# EAGLE design flight_teeny (EAGLE 9.2.2)
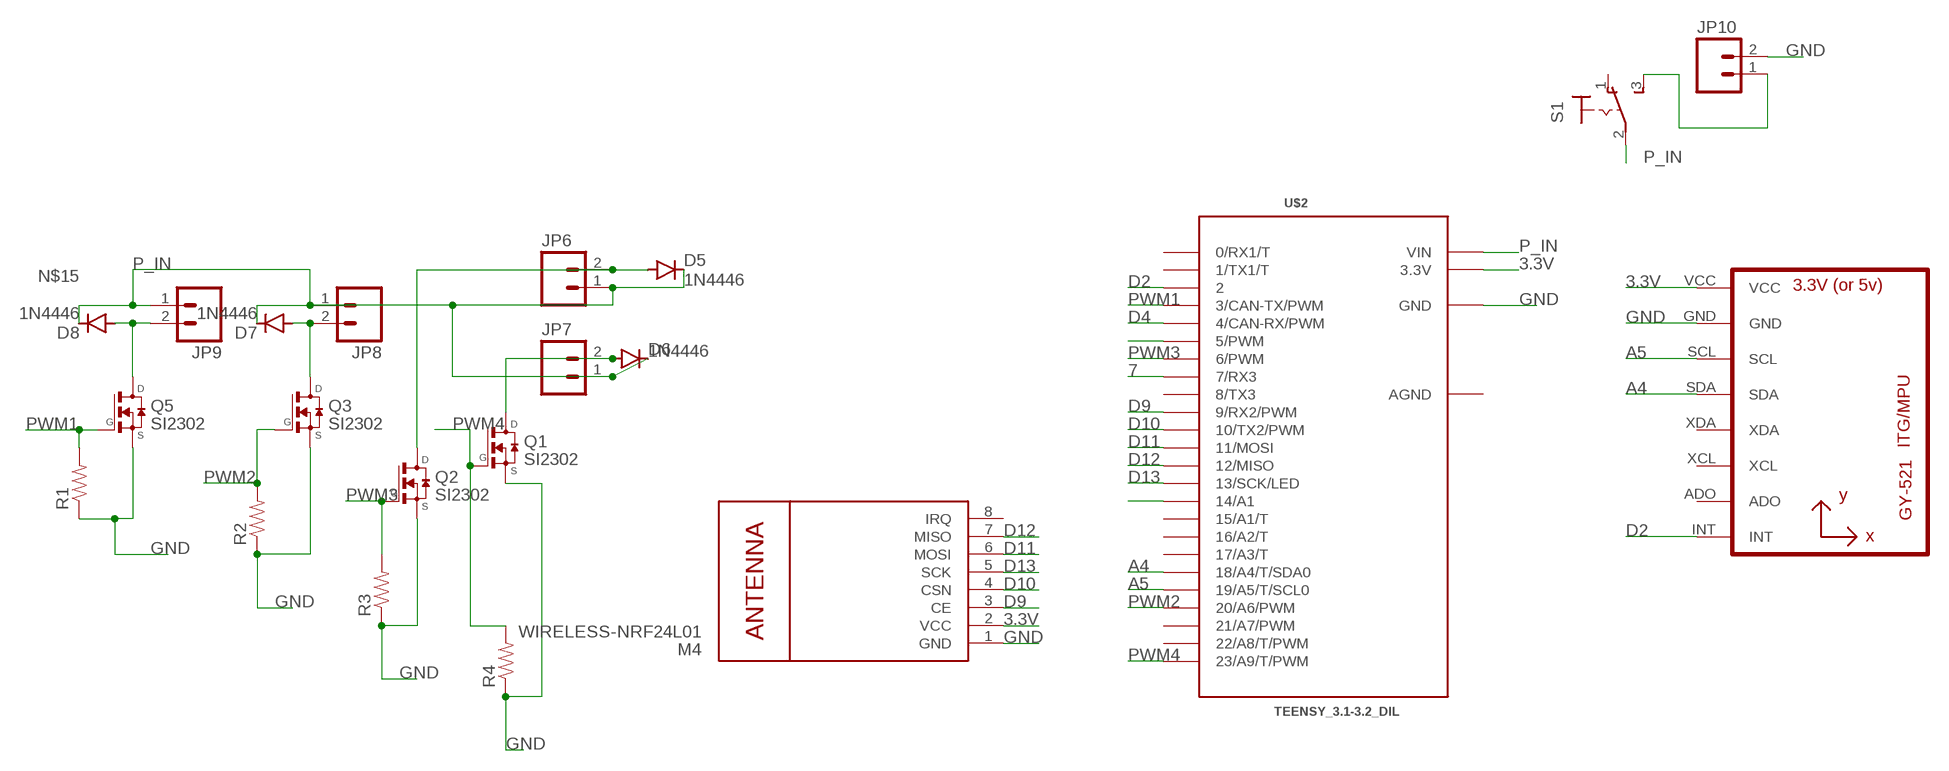
[diagram p0: schematic, sheet 1]

## Parts
D5  1N4446  [DO35-10]
D6  1N4446  [DO35-10]
D7  1N4446  [DO35-10]
D8  1N4446  [DO35-10]
JP6  M021X02_NO_SILK  [1X02_NO_SILK]
JP7  M021X02_NO_SILK  [1X02_NO_SILK]
JP8  M021X02_NO_SILK  [1X02_NO_SILK]
JP9  M021X02_NO_SILK  [1X02_NO_SILK]
JP10  M02PTH  [1X02]
M4  WIRELESS-NRF24L01  [WIRELESS-NRF24L01]
Q1  SI2302  [SOT23]
Q2  SI2302  [SOT23]
Q3  SI2302  [SOT23]
Q5  SI2302  [SOT23]
R1  RESISTORAXIAL-0.3  [AXIAL-0.3]
R2  RESISTORAXIAL-0.3  [AXIAL-0.3]
R3  RESISTORAXIAL-0.3  [AXIAL-0.3]
R4  RESISTORAXIAL-0.3  [AXIAL-0.3]
S1  M9040P  [M9040P]
U2  GY-521MPU6050  [GY-521]
U$2  TEENSY_3.1-3.2_DIL  [TEENSY_3.0-3.2&LC_DIL]

## Nets
3.3V: M4.2(VCC) U2.VCC U$2.3.3V
7: U$2.7(7/RX3)
A4: U2.SDA U$2.18/A4(18/A4/T/SDA0)
A5: U2.SCL U$2.19/A5(19/A5/T/SCL0)
D2: U2.INT U$2.2
D4: U$2.4(4/CAN-RX/PWM)
D9: M4.3(CE) U$2.9(9/RX2/PWM)
D10: M4.4(CSN) U$2.10(10/TX2/PWM)
D11: M4.6(MOSI) U$2.11(11/MOSI)
D12: M4.7(MISO) U$2.12(12/MISO)
D13: M4.5(SCK) U$2.13(13/SCK/LED)
GND: JP10.2 M4.1(GND) Q1.2(S) Q2.2(S) Q3.2(S) Q5.2(S) R1.P$1 R2.P$1 R3.P$1 R4.P$1 U2.GND U$2.GND
N$1: U$2.5(5/PWM)
N$2: D6.A JP7.2 Q1.3(D)
N$15: D8.A JP9.2 Q5.3(D)
N$20: U$2.14/A0(14/A1)
N$21: D5.A JP6.2 Q2.3(D)
N$24: D7.A JP8.2 Q3.3(D)
N$30: JP10.1 S1.3(S)
P_IN: D5.C D6.C D7.C D8.C JP6.1 JP7.1 JP8.1 JP9.1 S1.2(P) U$2.VIN
PWM1: Q5.1(G) R1.P$2 U$2.3(3/CAN-TX/PWM)
PWM2: Q3.1(G) R2.P$2 U$2.20/A6(20/A6/PWM)
PWM3: Q2.1(G) R3.P$2 U$2.6(6/PWM)
PWM4: Q1.1(G) R4.P$2 U$2.23/A9(23/A9/T/PWM)
Unconnected: M4.8(IRQ) S1.1(O) U2.ADO U2.XCL U2.XDA U$2.0(0/RX1/T) U$2.1(1/TX1/T) U$2.8(8/TX3) U$2.15/A1(15/A1/T) U$2.16/A2(16/A2/T) U$2.17/A3(17/A3/T) U$2.21/A7(21/A7/PWM) U$2.22/A8(22/A8/T/PWM)

## Power pins joined to a net without a drawn wire
AGND: U$2.AGND

## Library data of the parts
D5-D8 = diode:1N4446: DIODE high speed (Philips)
JP6-JP10 = SparkFun:M02: Header 2 Standard 2-pin 0.1" header. Use with straight break away headers (SKU : PRT-00116), right angle break away headers (PRT-00553), swiss pins (PRT-00743), machine pins (PRT-00117), and female headers (PRT-00115). Molex polarized connector foot print use with SKU : PRT-08233 with associated crimp pins and housings.
M4 = diy-modules:WIRELESS-NRF24L01: 2.4 GHz Wireless Module based on NRF24L01 chip More details available here: http://www.electrodragon.com/w/NRF24L01 Click here to find device on ebay.com <http://www.ebay.com/sch/nrf24l01+arduino>
Q1-Q3 Q5 = transistor-fet:SI2302: MOSFET N-Channel 20 V (D-S)
R1-R4 = SparkFun:RESISTOR: Resistor Basic schematic elements and footprints for 0603, 1206, and PTH resistors.
S1 = switch:M9040P: TOGGLE SWITCH Marquardt
U2 = gy-521:GY-521
U$2 = Teensy_3_and_LC_Series_Boards_v1.4:TEENSY_3.1-3.2_DIL: Teensy 3.1 or 3.2 in a DIL Layout.

## Board
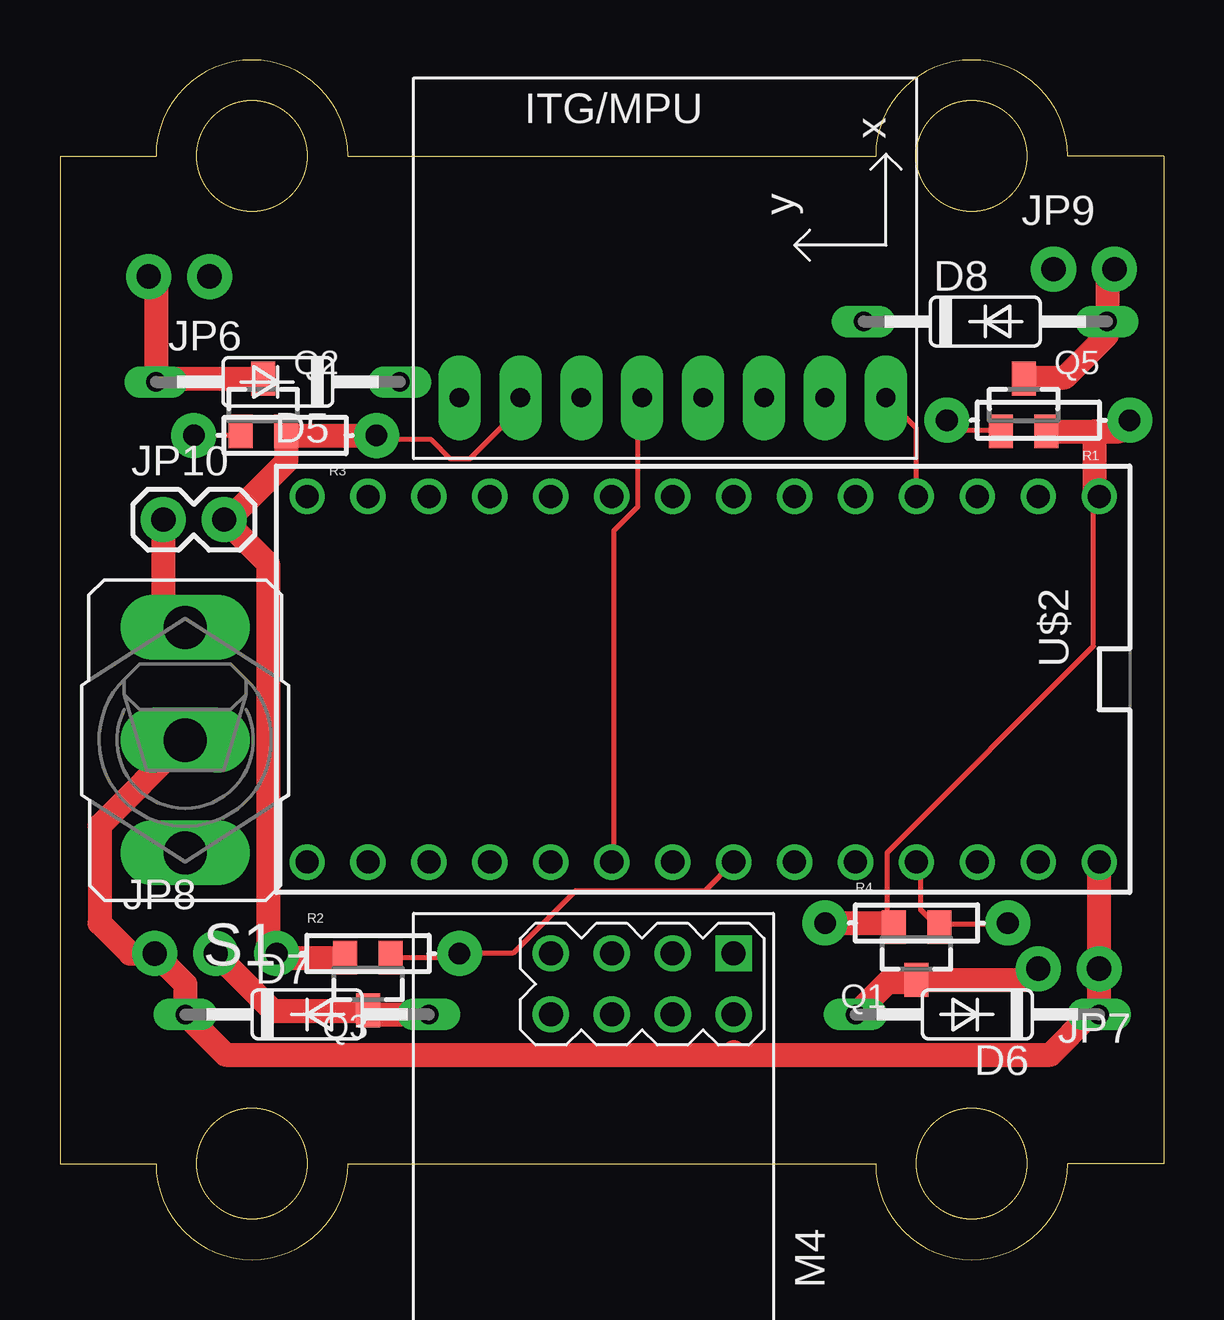
[diagram p1: board, top side]
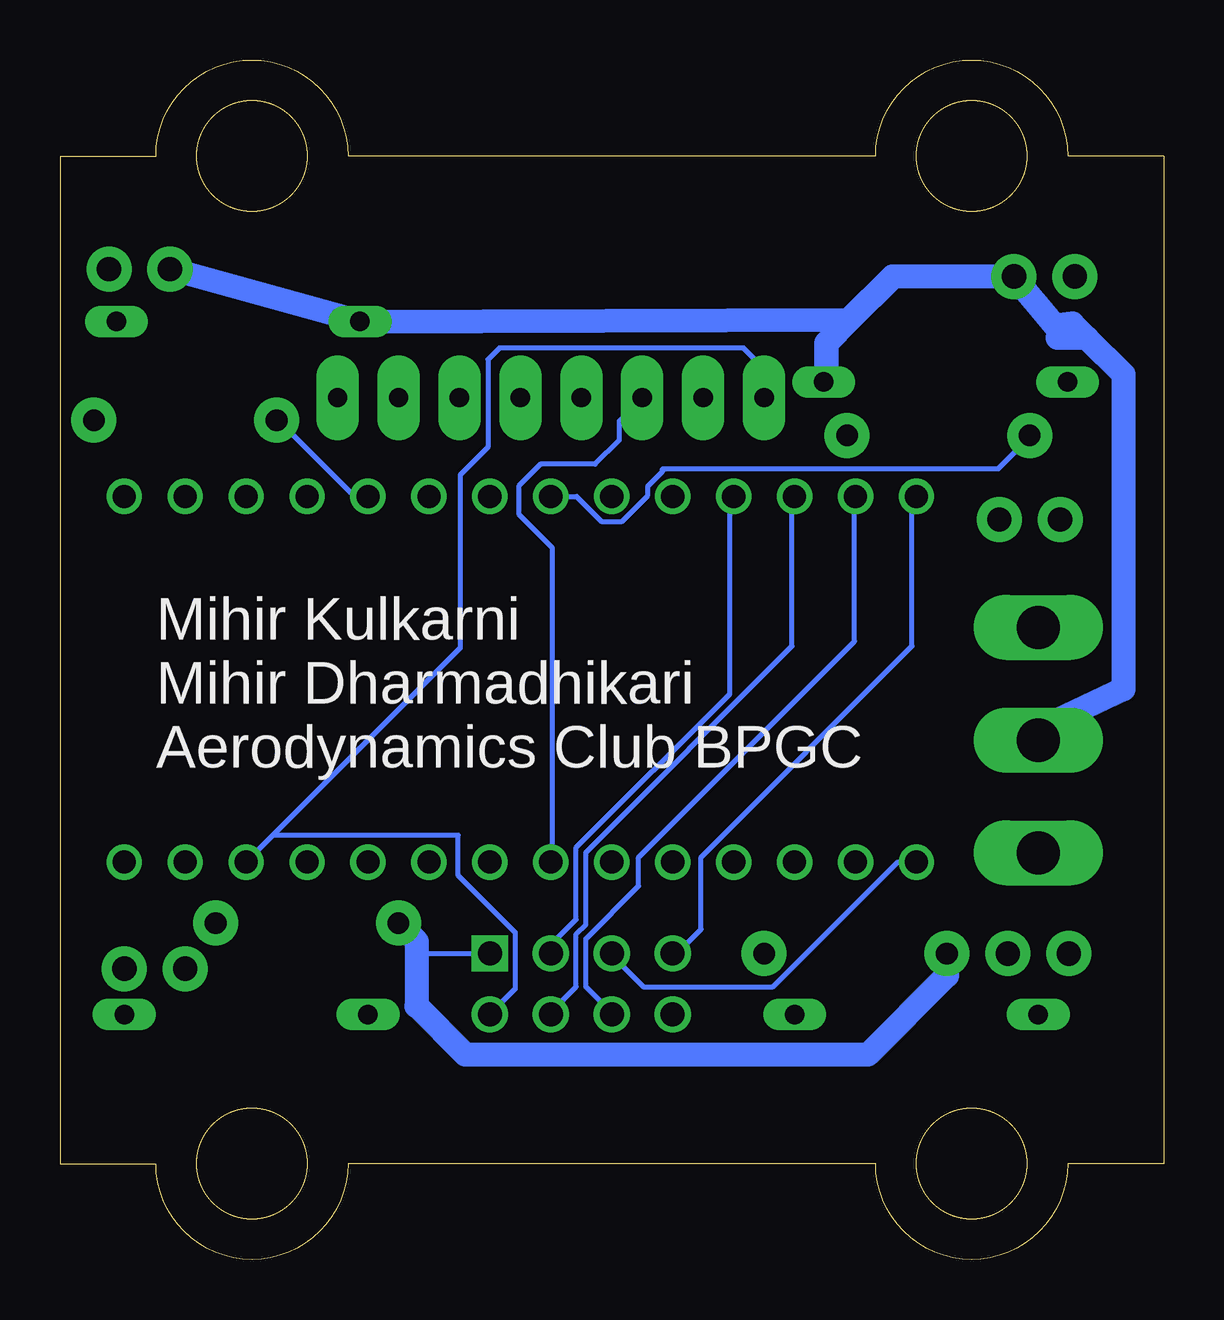
[diagram p2: board, bottom side, seen from below]

Size 46 x 50 mm. Coordinates in mm from the lower left corner, seen from the top.
Outline: 12,46 arc180 4,46 0,46 0,4 4,4 arc180 12,4 34,4 arc180 42,4 46,4 46,46 42,46 arc180 34,46 12,46
Outline: circle at 8,46 radius 2.3
Outline: circle at 38,46 radius 2.3
Outline: circle at 38,4 radius 2.3
Outline: circle at 8,4 radius 2.3
Copper layers (1*16): Top 0.035mm / dielectric 1.5mm / Bottom 0.035mm
Design rules "default *": minimum track width 0.2mm, minimum drill 0.35mm, track to track 0.2mm, track to pad 0.2mm, pad to pad 6mil, via to via 6mil, smd to smd 6mil, copper to edge 0.1mm, drill to drill 0.1mm, minimum pad ring 10mil, minimum via ring 8mil, stop-mask expansion 4mil, vias tented up to drill 0mil, thermal gap 10mil

### Footprints (pad centres in the part's own frame; a part is rotated, then mirrored left to right if it is on the bottom)
DO35-10 = drill 0.813 long: A 5.08,0; C -5.08,0
1X02_NO_SILK = drill 1.016 pad 1.88: 1 0,0; 2 2.54,0
1X02 = drill 1.016 pad 1.88: 1 0,0; 2 2.54,0
WIRELESS-NRF24L01 = drill 1 square: 1 -12.7,6.35 | drill 1: 2 -10.16,6.35; 3 -12.7,3.81; 4 -10.16,3.81; 5 -12.7,1.27; 6 -10.16,1.27; 7 -12.7,-1.27; 8 -10.16,-1.27
SOT23 = smd 1 x 1.4: 1 -0.95,-1.1; 2 0.95,-1.1; 3 0,1.1
AXIAL-0.3 = drill 0.9 pad 1.88: P$1 -3.81,0; P$2 3.81,0
M9040P = drill 1.803 long: 1 0,4.699; 2 0,0; 3 0,-4.699
GY-521 = drill 0.8 pad 1.778 long: ADO -8.89,-6.35; GND -8.89,6.35; INT -8.89,-8.89; SCL -8.89,3.81; SDA -8.89,1.27; VCC -8.89,8.89; XCL -8.89,-3.81; XDA -8.89,-1.27
TEENSY_3.0-3.2&LC_DIL = drill 0.965: 0 -7.62,13.97; 1 -7.62,11.43; 2 -7.62,8.89; 3 -7.62,6.35; 3.3V 7.62,11.43; 4 -7.62,3.81; 5 -7.62,1.27; 6 -7.62,-1.27; 7 -7.62,-3.81; 8 -7.62,-6.35; 9 -7.62,-8.89; 10 -7.62,-11.43; 11 -7.62,-13.97; 12 -7.62,-16.51; 13 7.62,-16.51; 14/A0 7.62,-13.97; 15/A1 7.62,-11.43; 16/A2 7.62,-8.89; 17/A3 7.62,-6.35; 18/A4 7.62,-3.81; 19/A5 7.62,-1.27; 20/A6 7.62,1.27; 21/A7 7.62,3.81; 22/A8 7.62,6.35; 23/A9 7.62,8.89; AGND 7.62,13.97; GND -7.62,16.51; VIN 7.62,16.51

### Placement (x,y rotation side)
D5  9.08,36.58 180 top
D6  38.24,10.22 180 top
D7  10.3,10.22 0 top
D8  38.57,39.1 0 top
JP6  6.24,40.98 180 top
JP7  43.32,12.12 180 top
JP8  3.95,12.76 0 top
JP9  41.41,41.28 0 top
JP10  4.31,30.84 0 top
M4  21.73,0.06 270 top
Q1  35.7,12.76 180 top
Q2  8.47,35.62 0 top
Q3  12.84,11.49 180 top
Q5  40.17,35.62 0 top
R1  40.78,34.98 180 top
R2  12.84,12.76 0 top
R3  9.39,34.35 180 top
R4  35.7,14.03 0 top
S1  5.22,21.65 180 top
U2  25.54,44.81 90 top
U$2  26.81,24.19 270 top

### Tracks (layer width: path | path; a pad name or v marks a point on that pad's centre or on a via)
3.3V
  Bottom 0.2: 37.07,17.74 29.32,25.49 29.32,32.7 28.16,33.86 28.16,37.52 27.68,38 17.51,38 16.65,37.14 U2.VCC | 37.07,17.74 U$2.3.3V | 37.07,17.74 37.02,17.68 29.4,17.68 29.4,16.01 27.03,13.63 27.03,11.27 M4.2
A4
  Top 0.2: U$2.18/A4 23.08,16.57 23.08,30.37 24.08,31.37 24.08,35.87 U2.SDA
A5
  Bottom 0.2: U$2.19/A5 25.48,16.57 25.48,29.67 26.88,31.07 26.88,32.24 25.97,33.15 23.69,33.15 22.7,34.14 22.7,34.96 U2.SCL
D2
  Top 0.2: U2.INT 35.68,34.67 35.68,31.97 U$2.2
D9
  Bottom 0.2: U$2.9 18.08,31.77 18.08,23.57 24.48,17.17 24.48,14.17 25.48,13.17 25.48,12.77 M4.3
D10
  Bottom 0.2: U$2.10 15.48,31.77 15.48,25.57 24.08,16.97 24.08,13.97 24.48,13.57 24.48,11.37 25.48,10.37 M4.4
D11
  Top 0.2: 23.08,10.37 M4.6
  Bottom 0.2: U$2.11 12.88,31.77 12.88,25.77 21.88,16.77 21.88,15.57 24.08,13.37 24.08,11.37 23.08,10.37 M4.6
D12
  Bottom 0.2: U$2.12 10.48,31.77 10.48,25.57 19.28,16.77 19.28,13.77 20.28,12.77 M4.7
D13
  Bottom 0.2: U$2.13 11.08,16.57 16.28,11.37 21.68,11.37 22.88,12.57 M4.5
GND
  Top 0.2: 11.88,12.57 Q3.2 | Q2.2 9.45,34.37 13.17,34.37 R3.P$1 13.68,34.17 15.48,34.17 16.28,33.37 17.08,33.37 19.48,35.76 U2.GND | 41.27,34.57 Q5.2 | U$2.GND 43.08,31.37 43.08,25.57 34.48,16.97 34.48,14.37 Q1.2
  Top 1: 11.88,12.57 9.21,12.57 R2.P$1 8.68,13.11 8.68,29.01 JP10.2 7.03,30.84 9.42,33.23 Q2.2 9.59,34.35 R3.P$1 13.25,34.35 | Q5.2 43.12,34.52 | 43.12,34.52 44.12,34.52 R1.P$1 | 43.12,34.52 43.12,32.01 U$2.GND | R4.P$1 34.58,14.03 Q1.2
  Bottom 0.2: 31.12,12.77 M4.1
  Bottom 1: R2.P$1 9.03,11.84 12.33,8.54 29.1,8.54 31.12,10.57 | 31.12,10.57 31.14,10.57 | 31.12,10.57 31.12,12.77 31.12,13.26 R4.P$1
N$2
  Top 0.2: 35.68,11.57 Q1.3
  Top 1: D6.A 34.51,11.57 35.68,11.57 | Q1.3 40.31,11.66 JP7.2
N$15
  Top 1: Q5.3 40.22,36.77 41.88,36.77 43.65,38.54 D8.A 43.65,40.98 JP9.2
N$21
  Top 0.2: 4.06,36.66 D5.A
  Top 1: JP6.2 4,40.67 D5.A 4.14,36.72 Q2.3
N$24
  Top 0.2: 12.88,10.37 Q3.3 12.68,10.57
  Top 1: JP8.2 8.88,10.37 12.88,10.37 | Q3.3 13.01,10.22 D7.A
N$30
  Top 1: JP10.1 4.31,27.26 S1.3
P_IN
  Top 0.2: U$2.VIN 43.28,16.57 43.28,12.2 43.28,12.17 JP7.1 43.28,11.97 43.28,10.37 D6.C 43.28,10.17 | 5.28,10.17 D7.C
  Top 1: S1.2 1.66,18.08 1.66,14.03 2.93,12.76 JP8.1 5.22,11.49 D7.C 6.9,8.54 28.18,8.54 | 28.18,8.54 41.29,8.54 42.96,10.21 D6.C | D6.C 43.32,12.16 43.28,12.2 | JP7.1 U$2.VIN | 28.08,8.64 28.18,8.54
  Bottom 0.2: 14.06,36.66 D5.C
  Bottom 1: 11.29,40.98 JP6.1 4.53,38.92 3.8,39.02 3.19,38.41 | S1.2 5.22,22.09 1.66,23.78 1.66,36.89 3.19,38.41 | JP9.1 D8.C 13.09,39.17 | 3.19,38.41 4.41,38.41
  Bottom 1.016: 11.29,40.98 13.09,39.17 14.06,38.21 14.06,36.66
PWM1
  Top 0.2: Q5.1 39.07,34.57 37.48,34.57 37.08,34.97 R1.P$2
  Bottom 0.2: U$2.3 33.28,31.97 33.88,31.97 36.88,34.97 R1.P$2
PWM2
  Top 0.2: Q3.1 13.88,12.57 16.48,12.57 R2.P$2 16.68,12.77 18.88,12.77 21.48,15.37 26.88,15.37 U$2.20/A6
  Bottom 0.2: 16.68,12.77 R2.P$2
PWM3
  Top 0.2: Q2.1 7.48,34.37 5.68,34.37 R3.P$2
  Bottom 0.2: R3.P$2 5.68,34.17 6.88,32.97 20.88,32.97 20.88,32.85 21.5,32.24 21.5,31.84 22.57,30.77 23.43,30.77 24.47,31.81 U$2.6
PWM4
  Top 0.2: R4.P$2 39.48,13.97 36.68,13.97 Q1.1 36.48,13.97 35.88,14.57 35.88,16.57 U$2.23/A9

### Text on the board
bPlace: Mihir Kulkarni / Mihir Dharmadhikari / Aerodynamics Club BPGC